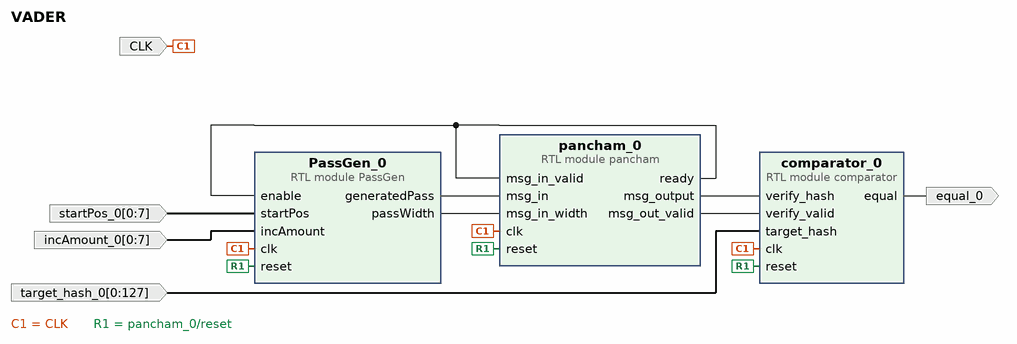
[diagram p0: block diagram of the top level]
# Vivado block design VADER, xc7a100tcsg324-1, Vivado 2019.2
create_bd_design VADER

create_bd_port -dir O equal_0
create_bd_port -dir I -from 0 -to 7 startPos_0
create_bd_port -dir I -from 0 -to 7 incAmount_0
create_bd_port -dir I CLK
create_bd_port -dir I -from 0 -to 127 target_hash_0

create_bd_cell -type module -reference pancham pancham_0
create_bd_cell -type module -reference PassGen PassGen_0
create_bd_cell -type module -reference comparator comparator_0

# ---- connections ----

connect_bd_net [get_bd_ports CLK] [get_bd_pins pancham_0/clk] [get_bd_pins PassGen_0/clk] [get_bd_pins comparator_0/clk]
connect_bd_net [get_bd_pins pancham_0/reset] [get_bd_pins PassGen_0/reset] [get_bd_pins comparator_0/reset]
connect_bd_net [get_bd_pins pancham_0/ready] [get_bd_pins pancham_0/msg_in_valid] [get_bd_pins PassGen_0/enable]
connect_bd_net [get_bd_pins PassGen_0/generatedPass] [get_bd_pins pancham_0/msg_in]
connect_bd_net [get_bd_pins PassGen_0/passWidth] [get_bd_pins pancham_0/msg_in_width]
connect_bd_net [get_bd_pins pancham_0/msg_output] [get_bd_pins comparator_0/verify_hash]
connect_bd_net [get_bd_pins pancham_0/msg_out_valid] [get_bd_pins comparator_0/verify_valid]
connect_bd_net [get_bd_pins comparator_0/equal] [get_bd_ports equal_0]
connect_bd_net -net startPos_0_1 [get_bd_ports startPos_0] [get_bd_pins PassGen_0/startPos]
connect_bd_net -net incAmount_0_1 [get_bd_ports incAmount_0] [get_bd_pins PassGen_0/incAmount]
connect_bd_net -net target_hash_0_1 [get_bd_ports target_hash_0] [get_bd_pins comparator_0/target_hash]

validate_bd_design
save_bd_design
